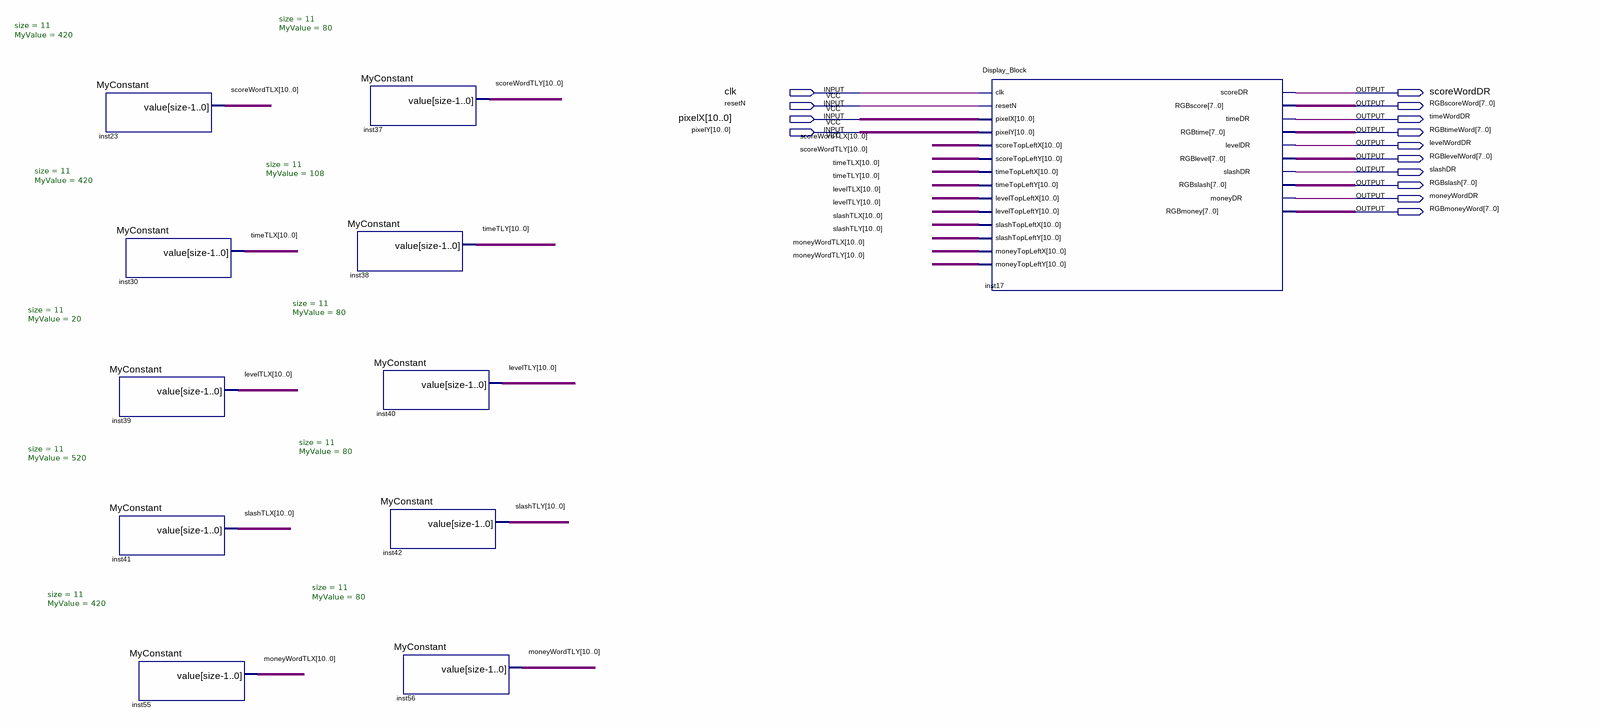
[diagram p0: schematic sheet]
// Quartus schematic Display_Top.bdf as structural Verilog: 11 symbols, 14 pins
module Display_Top (
  input  clk,
  input  resetN,
  input  [10:0] pixelX,
  input  [10:0] pixelY,
  output scoreWordDR,
  output [7:0] RGBscoreWord,
  output timeWordDR,
  output [7:0] RGBtimeWord,
  output levelWordDR,
  output [7:0] RGBlevelWord,
  output slashDR,
  output [7:0] RGBslash,
  output moneyWordDR,
  output [7:0] RGBmoneyWord
);

  wire [10:0] levelTLX, levelTLY, moneyWordTLX, moneyWordTLY, scoreWordTLX, scoreWordTLY, slashTLX, slashTLY,
       timeTLX, timeTLY;

  MyConstant #(.size(11), .MyValue(420)) inst23 (.value(scoreWordTLX));
  MyConstant #(.size(11), .MyValue(420)) inst30 (.value(timeTLX));
  MyConstant #(.size(11), .MyValue(20)) inst39 (.value(levelTLX));
  MyConstant #(.size(11), .MyValue(520)) inst41 (.value(slashTLX));
  MyConstant #(.size(11), .MyValue(420)) inst55 (.value(moneyWordTLX));
  MyConstant #(.size(11), .MyValue(108)) inst38 (.value(timeTLY));
  MyConstant #(.size(11), .MyValue(80)) inst37 (.value(scoreWordTLY));
  MyConstant #(.size(11), .MyValue(80)) inst40 (.value(levelTLY));
  MyConstant #(.size(11), .MyValue(80)) inst42 (.value(slashTLY));
  MyConstant #(.size(11), .MyValue(80)) inst56 (.value(moneyWordTLY));
  Display_Block inst17 (
    .clk(clk), .resetN(resetN), .pixelX(pixelX), .pixelY(pixelY), .scoreTopLeftX(scoreWordTLX),
    .scoreTopLeftY(scoreWordTLY), .timeTopLeftX(timeTLX), .timeTopLeftY(timeTLY), .levelTopLeftX(levelTLX),
    .levelTopLeftY(levelTLY), .slashTopLeftX(slashTLX), .slashTopLeftY(slashTLY),
    .moneyTopLeftX(moneyWordTLX), .moneyTopLeftY(moneyWordTLY), .scoreDR(scoreWordDR),
    .RGBscore(RGBscoreWord), .timeDR(timeWordDR), .RGBtime(RGBtimeWord), .levelDR(levelWordDR),
    .RGBlevel(RGBlevelWord), .slashDR(slashDR), .RGBslash(RGBslash), .moneyDR(moneyWordDR),
    .RGBmoney(RGBmoneyWord));
endmodule
